# EasyEDA schematic 4.36.json
TITLE: Sheet_1; REV: 1.0; Date: 2020-11-17; Sheet: 1/1; Drawn By: Gökbey Keskin; Company: Your Company
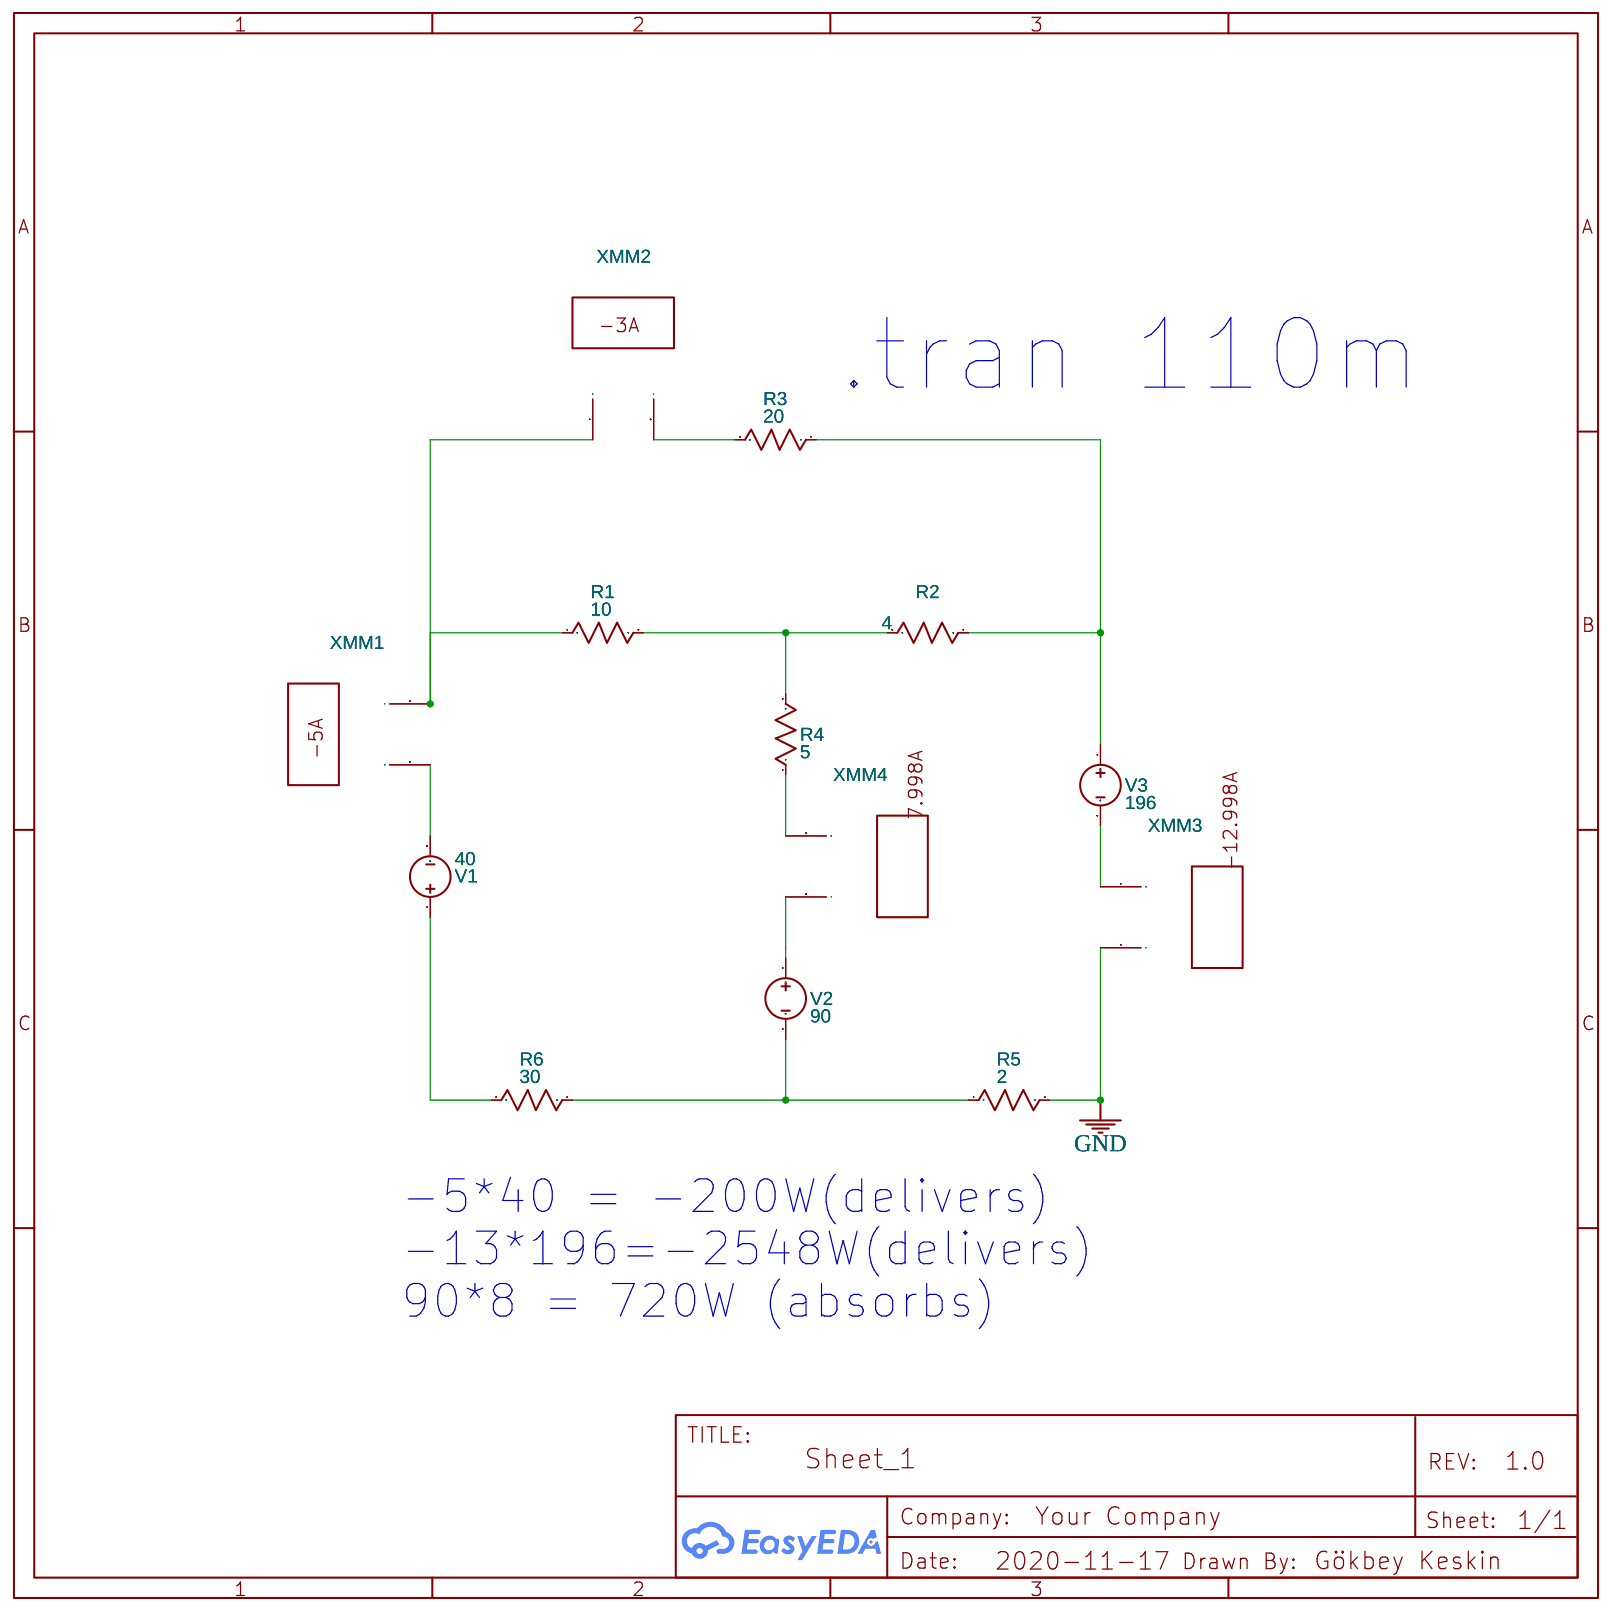
[diagram p0: schematic sheet]

## Parts
R1  10  [AXIAL-0.3]
R2  4  [AXIAL-0.3]
R3  20  [AXIAL-0.3]
R4  5  [AXIAL-0.3]
R5  2  [AXIAL-0.3]
R6  30  [AXIAL-0.3]
V1  40  [HDR1X2]
V2  90  [HDR1X2]
V3  196  [HDR1X2]
XMM1  Multimeter
XMM2  Multimeter
XMM3  Multimeter
XMM4  Multimeter

## Library data of the parts
R1-R6 = Resistor_US: Resistance: 1k; Contributor: EasyEDA; Supplier: YUJING
V1-V3 = VDC: Contributor: EasyEDA; sim: true
XMM1-XMM4 = MULTIMETER: Supplier: LCSC; Multimeter Type: Amper; Power Type: AC; Voltmeter resistance: 10μ; Ammeter resistance: 1G; NameDisplay: 0; Contributor: EasyEDA; sim: true

## Nets
GND: R5.2 XMM3.2(I)
Net-(R1-1): R1.1 XMM1.2(I) XMM2.1(+)
Net-(R1-2): R1.2 R2.1 R4.2
Net-(R2-2): R2.2 R3.1 V3.1
Net-(R3-2): R3.2 XMM2.2(I)
Net-(R4-1): R4.1 XMM4.1(+)
Net-(R5-1): R5.1 R6.2 V2.2
Net-(R6-1): R6.1 V1.1
Net-(V1-2): V1.2 XMM1.1(+)
Net-(V2-1): V2.1 XMM4.2(I)
Net-(V3-2): V3.2 XMM3.1(+)

## Notes on the sheet
- .tran 110m
- -5*40 = -200W(delivers)
  -13*196=-2548W(delivers)
  90*8 = 720W (absorbs)
